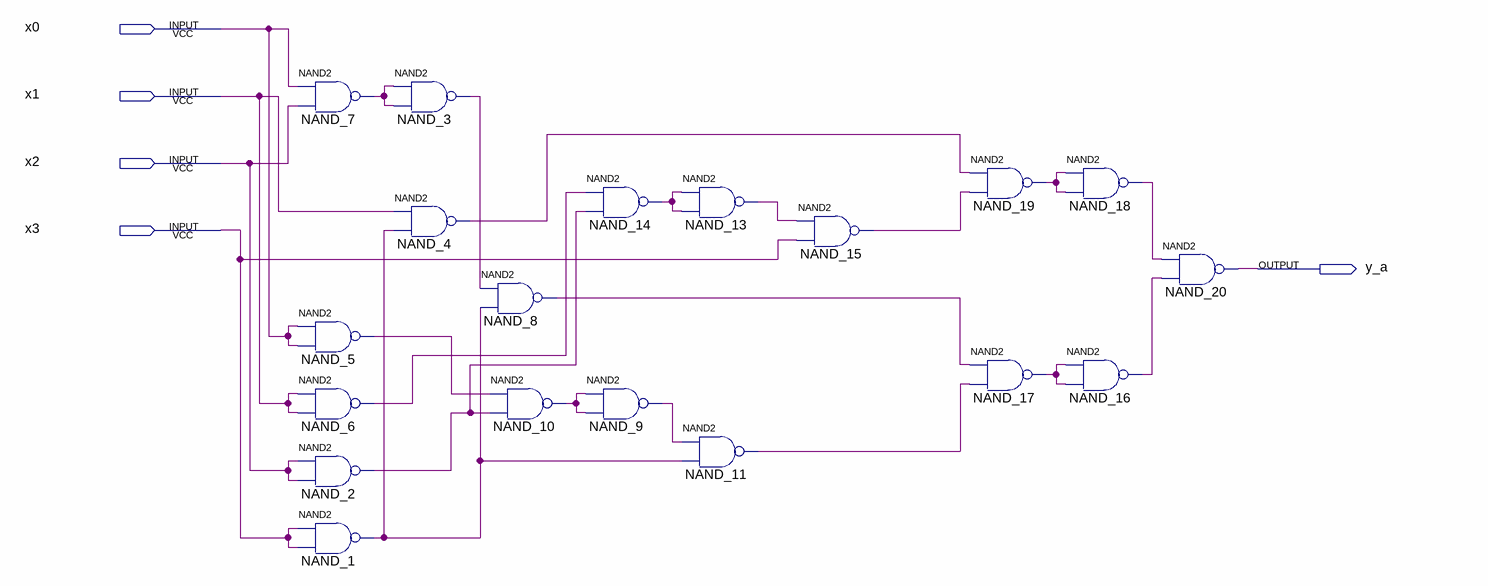
[diagram p0: schematic sheet]
// Quartus schematic a_schema.bdf as structural Verilog: 19 symbols, 5 pins
module a_schema (
  input  x0,
  input  x1,
  input  x2,
  input  x3,
  output y_a
);

  wire NAND_1_out, NAND_2_out, NAND_3_out, NAND_4_out, NAND_5_out, NAND_6_out, NAND_7_out, NAND_8_out,
       NAND_9_out, NAND_10_out, NAND_11_out, NAND_13_out, NAND_14_out, NAND_15_out, NAND_16_out, NAND_17_out,
       NAND_18_out, NAND_19_out;

  nand NAND_7 (NAND_7_out, x0, x2);
  nand NAND_5 (NAND_5_out, x0, x0);
  nand NAND_6 (NAND_6_out, x1, x1);
  nand NAND_2 (NAND_2_out, x2, x2);
  nand NAND_1 (NAND_1_out, x3, x3);
  nand NAND_3 (NAND_3_out, NAND_7_out, NAND_7_out);
  nand NAND_4 (NAND_4_out, x1, NAND_1_out);
  nand NAND_8 (NAND_8_out, NAND_3_out, NAND_1_out);
  nand NAND_10 (NAND_10_out, NAND_5_out, NAND_2_out);
  nand NAND_14 (NAND_14_out, NAND_6_out, NAND_2_out);
  nand NAND_9 (NAND_9_out, NAND_10_out, NAND_10_out);
  nand NAND_13 (NAND_13_out, NAND_14_out, NAND_14_out);
  nand NAND_11 (NAND_11_out, NAND_9_out, NAND_1_out);
  nand NAND_15 (NAND_15_out, NAND_13_out, x3);
  nand NAND_19 (NAND_19_out, NAND_4_out, NAND_15_out);
  nand NAND_17 (NAND_17_out, NAND_8_out, NAND_11_out);
  nand NAND_18 (NAND_18_out, NAND_19_out, NAND_19_out);
  nand NAND_16 (NAND_16_out, NAND_17_out, NAND_17_out);
  nand NAND_20 (y_a, NAND_18_out, NAND_16_out);
endmodule
